# EAGLE schematic dynamic_mic_preamp (EAGLE 7.1.0)
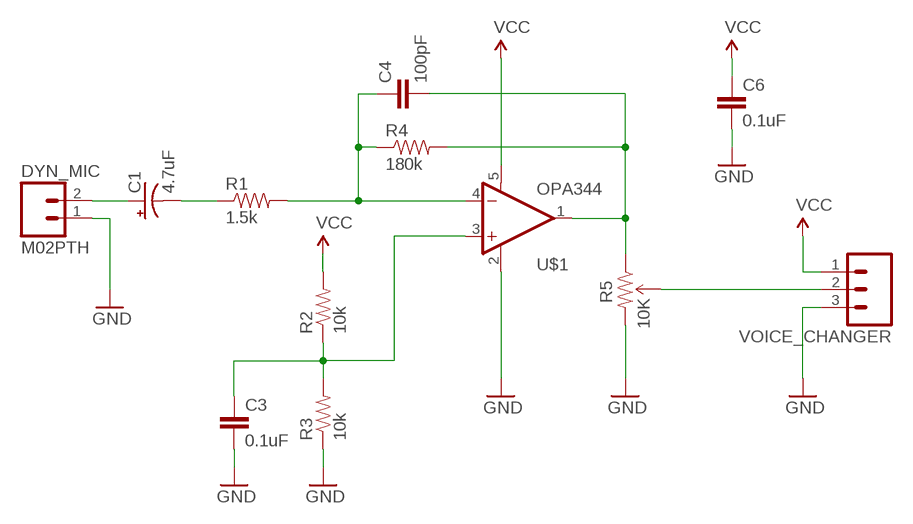
[diagram p0: schematic, sheet 1]

## Parts
C1  4.7uF  CAP_POLPTH1  [CPOL-RADIAL-100UF-25V]
C3  0.1uF  CAPPTH  [CAP-PTH-SMALL]
C4  100pF  CAPPTH  [CAP-PTH-SMALL]
C6  0.1uF  CAPPTH  [CAP-PTH-SMALL]
DYN_MIC  M02PTH  [1X02]
R1  1.5k  RESISTORPTH-1/4W  [AXIAL-0.4]
R2  10k  RESISTORPTH-1/4W  [AXIAL-0.4]
R3  10k  RESISTORPTH-1/4W  [AXIAL-0.4]
R4  180k  RESISTORPTH-1/4W  [AXIAL-0.4]
R5  10K  TRIMPOT  [TRIMPOT-5MM-V2]
U$1  OPA344  [SOT23-5]
VOICE_CHANGER  M03PTH  [1X03]

## Nets
GND: C3.2 C6.2 DYN_MIC.1 R3.P$1 R5.C(CW) U$1.2(V-) VOICE_CHANGER.3
N$1: C1.2(-) R1.P$1
N$2: C4.1 R1.P$2 R4.P$1 U$1.4(-IN)
N$3: C3.1 R2.P$1 R3.P$2 U$1.3(+IN)
N$4: C4.2 R4.P$2 R5.A(CCW) U$1.1(OUT)
N$5: R5.B(WIPER) VOICE_CHANGER.2
N$7: C1.1(+) DYN_MIC.2
VCC: C6.1 R2.P$2 U$1.5(V+) VOICE_CHANGER.1

## Library data of the parts
C1 = SparkFun-Passives:CAP_POL: Capacitor Polarized These are standard SMD and PTH capacitors. Normally 10uF, 47uF, and 100uF in electrolytic and tantalum varieties. Always verify the external diameter of the through hole cap, it varies with capacity, voltage, and manufacturer. The EIA devices should be standard.
C3 C4 C6 = SparkFun-Passives:CAP: Capacitor Standard 0603 ceramic capacitor, and 0.1" leaded capacitor.
DYN_MIC = SparkFun-Connectors:M02: Standard 2-pin 0.1" header. Use with - straight break away headers ( PRT-00116) - right angle break away headers (PRT-00553) - swiss pins (PRT-00743) - machine pins (PRT-00117) - female headers (PRT-00115) Molex polarized connector foot print use with: PRT-08233 with associated crimp pins and housings. 2.54_SCREWTERM for use with PRT-10571. 3.5mm Screw Terminal footprints for PRT-08084 5mm Screw Terminal footprints for use with PRT-08432
R1-R4 = SparkFun-Passives:RESISTOR: Resistor Basic schematic elements and footprints for 0603, 1206, and PTH resistors.
R5 = SparkFun-Electromechanical:TRIMPOT: Various small potentiometers for "set-and-forget" applications
U$1 = SparkFun-AnalogIC:OPA344: Single gate rail-to-rail output op-amp. Inputs extend 300mV past rails.
VOICE_CHANGER = SparkFun-Connectors:M03: Header 3 Standard 3-pin 0.1" header. Use with straight break away headers (SKU : PRT-00116), right angle break away headers (PRT-00553), swiss pins (PRT-00743), machine pins (PRT-00117), and female headers (PRT-00115). Molex polarized connector foot print use with SKU : PRT-08232 with associated crimp pins and housings.